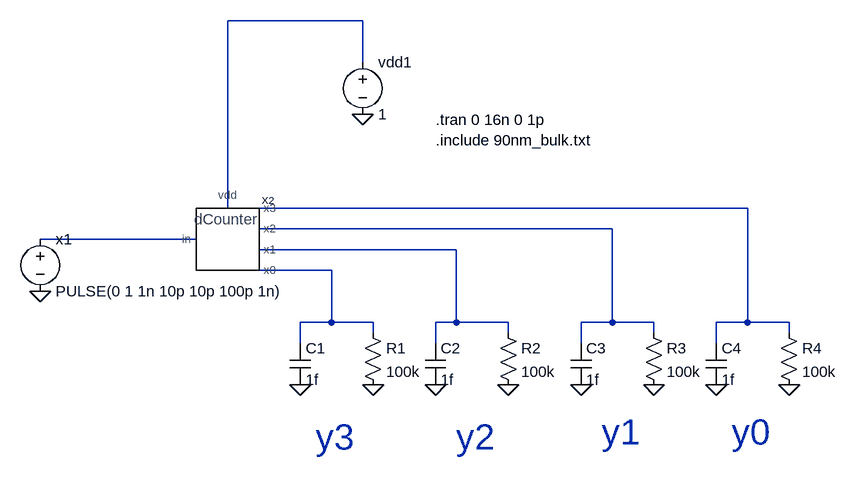
[diagram p0: schematic decCounter-test.asc]
decCounter-test.asc, the LTspice schematic file:
Version 4
SHEET 1 4180 1316
WIRE 1376 -208 1168 -208
WIRE 1376 -144 1376 -208
WIRE 1168 80 1168 -208
WIRE 1968 80 1216 80
WIRE 1760 112 1216 112
WIRE 1120 128 880 128
WIRE 1520 144 1216 144
WIRE 1328 176 1216 176
WIRE 1328 256 1328 176
WIRE 1328 256 1280 256
WIRE 1392 256 1328 256
WIRE 1520 256 1520 144
WIRE 1520 256 1488 256
WIRE 1600 256 1520 256
WIRE 1760 256 1760 112
WIRE 1760 256 1712 256
WIRE 1824 256 1760 256
WIRE 1968 256 1968 80
WIRE 1968 256 1920 256
WIRE 2032 256 1968 256
WIRE 1392 272 1392 256
WIRE 1600 272 1600 256
WIRE 1824 272 1824 256
WIRE 2032 272 2032 256
WIRE 1280 288 1280 256
WIRE 1488 288 1488 256
WIRE 1712 288 1712 256
WIRE 1920 288 1920 256
FLAG 880 208 0
FLAG 1376 -64 0
FLAG 1280 352 0
FLAG 1392 352 0
FLAG 1488 352 0
FLAG 1600 352 0
FLAG 1712 352 0
FLAG 1824 352 0
FLAG 1920 352 0
FLAG 2032 352 0
SYMBOL voltage 880 112 R0
WINDOW 123 0 0 Left 2
WINDOW 39 0 0 Left 2
SYMATTR InstName x1
SYMATTR Value PULSE(0 1 1n 10p 10p 100p 1n)
SYMBOL voltage 1376 -160 R0
WINDOW 123 0 0 Left 2
WINDOW 39 0 0 Left 2
SYMATTR InstName vdd1
SYMATTR Value 1
SYMBOL res 1376 256 R0
SYMATTR InstName R1
SYMATTR Value 100k
SYMBOL cap 1264 288 R0
SYMATTR InstName C1
SYMATTR Value 1f
SYMBOL res 1584 256 R0
SYMATTR InstName R2
SYMATTR Value 100k
SYMBOL cap 1472 288 R0
SYMATTR InstName C2
SYMATTR Value 1f
SYMBOL res 1808 256 R0
SYMATTR InstName R3
SYMATTR Value 100k
SYMBOL cap 1696 288 R0
SYMATTR InstName C3
SYMATTR Value 1f
SYMBOL res 2016 256 R0
SYMATTR InstName R4
SYMATTR Value 100k
SYMBOL cap 1904 288 R0
SYMATTR InstName C4
SYMATTR Value 1f
SYMBOL DecCounter 1168 128 R0
SYMATTR InstName X2
TEXT 1488 -24 Left 2 !.include 90nm_bulk.txt
TEXT 1488 -56 Left 2 !.tran 0 16n 0 1p
TEXT 1944 424 Left 5 ;y0
TEXT 1744 424 Left 5 ;y1
TEXT 1520 432 Left 5 ;y2
TEXT 1304 432 Left 5 ;y3

The netlist it stands for:
* decCounter-test.asc
V§x1 N004 0 PULSE(0 1 1n 10p 10p 100p 1n)
vdd1 N001 0 1
R1 N006 0 100k
C1 N006 0 1f
R2 N005 0 100k
C2 N005 0 1f
R3 N003 0 100k
C3 N003 0 1f
R4 N002 0 100k
C4 N002 0 1f
XX2 N001 N004 N006 N005 N003 N002 DecCounter  ; pins vdd in x0 x1 x2 x3
.include 90nm_bulk.txt
.tran 0 16n 0 1p
* y0
* y1
* y2
* y3
.backanno
.end